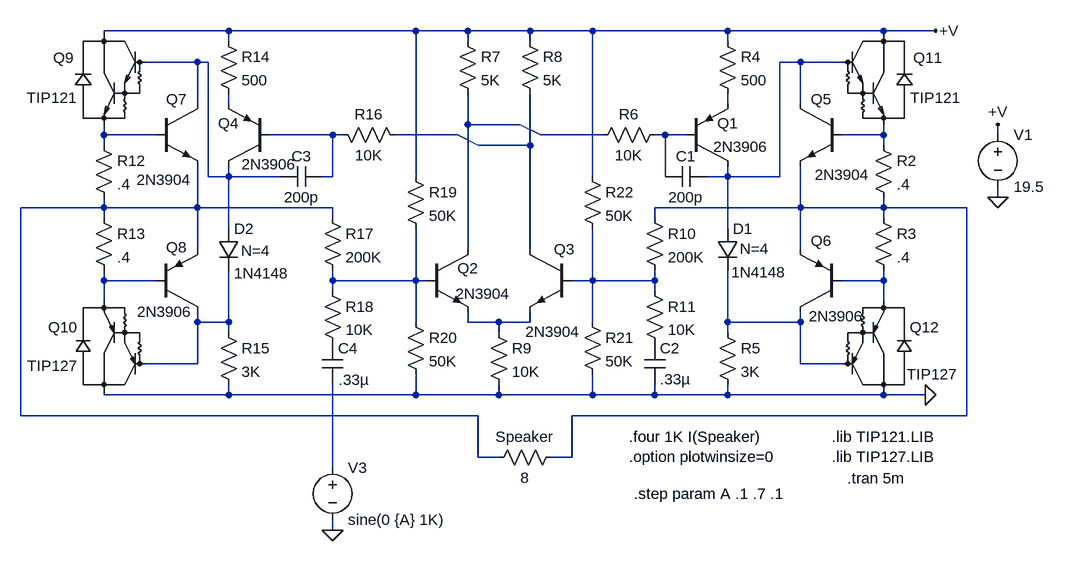
[diagram p0: schematic PowerAmp.asc]
PowerAmp.asc, the LTspice schematic file:
Version 4
SHEET 1 2208 904
WIRE -512 48 -704 48
WIRE -224 48 -512 48
WIRE -144 48 -224 48
WIRE -48 48 -144 48
WIRE 48 48 -48 48
WIRE 256 48 48 48
WIRE 496 48 256 48
WIRE 576 48 496 48
WIRE -512 64 -512 48
WIRE -144 64 -144 48
WIRE -48 64 -48 48
WIRE 256 64 256 48
WIRE -560 96 -640 96
WIRE -544 96 -560 96
WIRE 368 96 336 96
WIRE 432 96 368 96
WIRE -560 160 -560 96
WIRE -512 160 -512 144
WIRE 256 160 256 144
WIRE 368 160 368 96
WIRE -144 192 -144 144
WIRE -64 192 -144 192
WIRE -704 208 -704 192
WIRE -624 208 -704 208
WIRE -352 208 -448 208
WIRE -336 208 -352 208
WIRE -160 208 -256 208
WIRE -32 208 -64 192
WIRE 64 208 -32 208
WIRE 160 208 144 208
WIRE 192 208 160 208
WIRE 496 208 496 192
WIRE 496 208 432 208
WIRE 672 208 672 192
WIRE -704 224 -704 208
WIRE -128 224 -160 208
WIRE -48 224 -48 144
WIRE -48 224 -128 224
WIRE 496 224 496 208
WIRE -544 272 -544 96
WIRE -512 272 -512 256
WIRE -512 272 -544 272
WIRE -432 272 -512 272
WIRE -352 272 -352 208
WIRE -352 272 -368 272
WIRE -224 272 -224 48
WIRE 48 272 48 48
WIRE 160 272 160 208
WIRE 256 272 256 256
WIRE 256 272 224 272
WIRE 336 272 336 96
WIRE 336 272 256 272
WIRE 672 304 672 288
WIRE -704 320 -704 304
WIRE -704 320 -832 320
WIRE -560 320 -560 256
WIRE -560 320 -704 320
WIRE -352 320 -560 320
WIRE 368 320 368 256
WIRE 368 320 144 320
WIRE 496 320 496 304
WIRE 496 320 368 320
WIRE 624 320 496 320
WIRE -704 336 -704 320
WIRE -352 336 -352 320
WIRE 144 336 144 320
WIRE 496 336 496 320
WIRE -512 352 -512 272
WIRE 256 352 256 272
WIRE -560 384 -560 320
WIRE -144 384 -144 192
WIRE -48 384 -48 224
WIRE 368 384 368 320
WIRE -704 432 -704 416
WIRE -624 432 -704 432
WIRE -352 432 -352 416
WIRE -224 432 -224 352
WIRE -224 432 -352 432
WIRE -208 432 -224 432
WIRE 48 432 48 352
WIRE 48 432 16 432
WIRE 144 432 144 416
WIRE 144 432 48 432
WIRE 496 432 496 416
WIRE 496 432 432 432
WIRE -352 448 -352 432
WIRE 144 448 144 432
WIRE -704 464 -704 432
WIRE 496 464 496 432
WIRE -560 496 -560 480
WIRE -512 496 -512 416
WIRE -512 496 -560 496
WIRE -224 496 -224 432
WIRE -144 496 -144 480
WIRE -96 496 -144 496
WIRE -48 496 -48 480
WIRE -48 496 -96 496
WIRE 48 496 48 432
WIRE 256 496 256 416
WIRE 368 496 368 480
WIRE 368 496 256 496
WIRE -512 512 -512 496
WIRE -96 512 -96 496
WIRE 256 512 256 496
WIRE -560 560 -560 496
WIRE -560 560 -640 560
WIRE 368 560 368 496
WIRE 432 560 368 560
WIRE -512 608 -512 592
WIRE -512 608 -704 608
WIRE -224 608 -224 576
WIRE -224 608 -512 608
WIRE -96 608 -96 592
WIRE -96 608 -224 608
WIRE 48 608 48 576
WIRE 48 608 -96 608
WIRE 144 608 144 592
WIRE 144 608 48 608
WIRE 256 608 256 592
WIRE 256 608 144 608
WIRE 496 608 256 608
WIRE 560 608 496 608
WIRE -832 640 -832 320
WIRE -128 640 -832 640
WIRE 624 640 624 320
WIRE 624 640 16 640
WIRE -128 704 -128 640
WIRE -96 704 -128 704
WIRE 16 704 16 640
WIRE 16 704 -16 704
WIRE -352 720 -352 592
WIRE -352 816 -352 800
FLAG 672 192 +V
FLAG 672 304 0
FLAG 576 48 +V
FLAG -352 816 0
FLAG 560 608 0
SYMBOL ndarlington 496 112 R0
WINDOW 0 46 -23 Left 0
WINDOW 3 41 39 Left 0
WINDOW 123 41 67 Left 0
SYMATTR InstName Q11
SYMATTR Value TIP121
SYMATTR Prefix X
SYMBOL pdarlington 496 544 R0
WINDOW 0 40 -40 Left 0
WINDOW 3 36 32 Left 0
WINDOW 123 14 91 Left 0
SYMATTR InstName Q12
SYMATTR Value TIP127
SYMATTR Prefix X
SYMBOL voltage 672 192 R0
SYMATTR InstName V1
SYMATTR Value 19.5
SYMBOL res 0 688 R90
WINDOW 0 0 56 VBottom 0
WINDOW 3 32 56 VTop 0
SYMATTR InstName Speaker
SYMATTR Value 8
SYMBOL res 480 208 R0
SYMATTR InstName R2
SYMATTR Value .4
SYMBOL res 480 320 R0
SYMATTR InstName R3
SYMATTR Value .4
SYMBOL pnp 192 256 M180
WINDOW 0 48 66 Left 0
WINDOW 3 42 30 Left 0
SYMATTR InstName Q1
SYMATTR Value 2N3906
SYMBOL res 240 48 R0
SYMATTR InstName R4
SYMATTR Value 500
SYMBOL diode 240 352 R0
WINDOW 3 22 67 Left 0
WINDOW 123 35 31 Left 0
SYMATTR Value 1N4148
SYMATTR Value2 N=4
SYMATTR InstName D1
SYMBOL cap 224 256 R90
WINDOW 0 0 32 VBottom 0
WINDOW 3 32 32 VTop 0
SYMATTR InstName C1
SYMATTR Value 200p
SYMBOL res 240 496 R0
SYMATTR InstName R5
SYMATTR Value 3K
SYMBOL res 160 192 R90
WINDOW 0 0 56 VBottom 0
WINDOW 3 32 56 VTop 0
SYMATTR InstName R6
SYMATTR Value 10K
SYMBOL npn -208 384 R0
WINDOW 0 48 29 Left 0
WINDOW 3 45 68 Left 0
SYMATTR InstName Q2
SYMATTR Value 2N3904
SYMBOL npn 16 384 M0
WINDOW 0 27 0 Right 0
WINDOW 3 71 127 Right 0
SYMATTR InstName Q3
SYMATTR Value 2N3904
SYMBOL res -160 48 R0
SYMATTR InstName R7
SYMATTR Value 5K
SYMBOL res -64 48 R0
SYMATTR InstName R8
SYMATTR Value 5K
SYMBOL res -112 496 R0
SYMATTR InstName R9
SYMATTR Value 10K
SYMBOL cap 128 528 R0
SYMATTR InstName C2
SYMATTR Value .33µ
SYMBOL res 128 320 R0
SYMATTR InstName R10
SYMATTR Value 200K
SYMBOL res 128 432 R0
SYMATTR InstName R11
SYMATTR Value 10K
SYMBOL ndarlington -704 112 M0
WINDOW 0 46 -23 Left 0
WINDOW 3 41 39 Left 0
WINDOW 123 41 67 Left 0
SYMATTR InstName Q9
SYMATTR Value TIP121
SYMATTR Prefix X
SYMBOL pdarlington -704 544 M0
WINDOW 0 40 -40 Left 0
WINDOW 3 40 19 Left 0
WINDOW 123 9 95 Left 0
SYMATTR InstName Q10
SYMATTR Value TIP127
SYMATTR Prefix X
SYMBOL res -720 208 R0
SYMATTR InstName R12
SYMATTR Value .4
SYMBOL res -720 320 R0
SYMATTR InstName R13
SYMATTR Value .4
SYMBOL pnp -448 256 R180
WINDOW 0 48 66 Left 0
WINDOW 3 44 3 Right 0
SYMATTR InstName Q4
SYMATTR Value 2N3906
SYMBOL res -528 48 R0
SYMATTR InstName R14
SYMATTR Value 500
SYMBOL diode -528 352 R0
WINDOW 3 24 69 Left 0
WINDOW 123 35 34 Left 0
SYMATTR Value 1N4148
SYMATTR Value2 N=4
SYMATTR InstName D2
SYMBOL cap -432 256 M90
WINDOW 0 0 32 VBottom 0
WINDOW 3 32 32 VTop 0
SYMATTR InstName C3
SYMATTR Value 200p
SYMBOL res -528 496 R0
SYMATTR InstName R15
SYMATTR Value 3K
SYMBOL res -352 192 M90
WINDOW 0 0 56 VBottom 0
WINDOW 3 32 56 VTop 0
SYMATTR InstName R16
SYMATTR Value 10K
SYMBOL cap -368 528 R0
WINDOW 3 25 57 Left 0
SYMATTR InstName C4
SYMATTR Value .33µ
SYMBOL res -368 320 R0
SYMATTR InstName R17
SYMATTR Value 200K
SYMBOL res -368 432 R0
SYMATTR InstName R18
SYMATTR Value 10K
SYMBOL res -240 256 R0
SYMATTR InstName R19
SYMATTR Value 50K
SYMBOL res -240 480 R0
SYMATTR InstName R20
SYMATTR Value 50K
SYMBOL res 32 480 R0
SYMATTR InstName R21
SYMATTR Value 50K
SYMBOL res 32 256 R0
SYMATTR InstName R22
SYMATTR Value 50K
SYMBOL voltage -352 704 R0
WINDOW 123 0 0 Left 0
WINDOW 39 0 0 Left 0
SYMATTR InstName V3
SYMATTR Value sine(0 {A} 1K)
SYMBOL npn 432 160 M0
WINDOW 0 48 -7 Right 0
WINDOW 3 42 109 Right 0
SYMATTR InstName Q5
SYMATTR Value 2N3904
SYMBOL pnp 432 480 R180
WINDOW 0 48 109 Right 0
WINDOW 3 51 -7 Right 0
SYMATTR InstName Q6
SYMATTR Value 2N3906
SYMBOL npn -624 160 R0
WINDOW 0 48 -7 Right 0
WINDOW 3 55 117 Right 0
SYMATTR InstName Q7
SYMATTR Value 2N3904
SYMBOL pnp -624 480 M180
WINDOW 0 48 99 Right 0
WINDOW 3 56 0 Right 0
SYMATTR InstName Q8
SYMATTR Value 2N3906
TEXT 440 736 Left 0 !.tran 5m
TEXT 104 672 Left 0 !.four 1K I(Speaker)\n.option plotwinsize=0
TEXT 112 760 Left 0 !.step param A .1 .7 .1
TEXT 416 672 Left 0 !.lib TIP121.LIB\n.lib TIP127.LIB

The netlist it stands for:
* PowerAmp.asc
XQ11 +V N002 N010 ndarlington params: TIP121  ; pins C B E
XQ12 0 N019 N016 pdarlington params: TIP127  ; pins C B E
V1 +V 0 19.5
R§Speaker N012 N011 8
R2 N010 N012 .4
R3 N012 N016 .4
Q1 N002 N009 N004 0 2N3906
R4 +V N004 500
D1 N002 N019 1N4148 N=4
C1 N002 N009 200p
R5 N019 0 3K
R6 N009 N005 10K
Q2 N005 N014 N018 0 2N3904
Q3 N008 N015 N018 0 2N3904
R7 +V N005 5K
R8 +V N008 5K
R9 N018 0 10K
C2 P001 0 .33µ
R10 N012 N015 200K
R11 N015 P001 10K
XQ9 +V N001 N006 ndarlington params: TIP121  ; pins C B E
XQ10 0 N017 N013 pdarlington params: TIP127  ; pins C B E
R12 N006 N011 .4
R13 N011 N013 .4
Q4 N001 N007 N003 0 2N3906
R14 +V N003 500
D2 N001 N017 1N4148 N=4
C3 N001 N007 200p
R15 N017 0 3K
R16 N007 N008 10K
C4 P002 N020 .33µ
R17 N011 N014 200K
R18 N014 P002 10K
R19 +V N014 50K
R20 N014 0 50K
R21 N015 0 50K
R22 +V N015 50K
V3 N020 0 sine(0 {A} 1K)
Q5 N002 N010 N012 0 2N3904
Q6 N019 N016 N012 0 2N3906
Q7 N001 N006 N011 0 2N3904
Q8 N017 N013 N011 0 2N3906
.model D D
.lib standard.dio
.model NPN NPN
.model PNP PNP
.lib standard.bjt
.tran 5m
.four 1K I(Speaker)
.option plotwinsize=0
.step param A .1 .7 .1
.lib TIP121.LIB
.lib TIP127.LIB
.backanno
.end